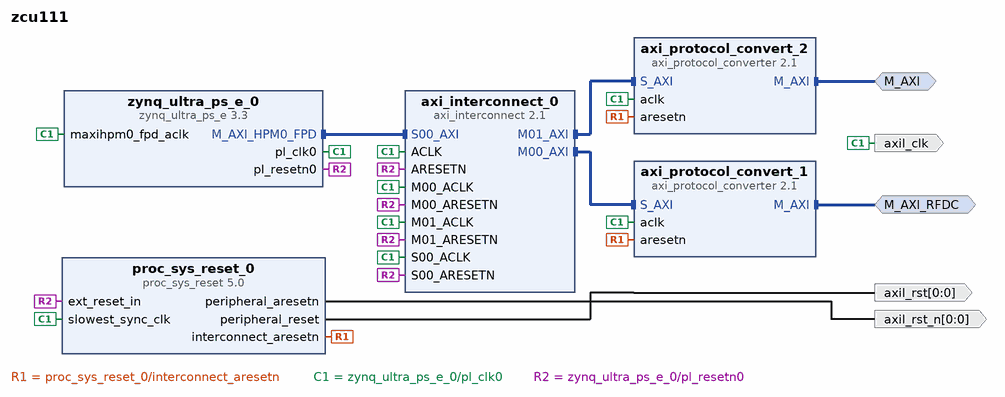
[diagram p0: block diagram of the top level]
# Vivado block design zcu111, xczu28dr-ffvg1517-2-e, Vivado 2019.1.3
create_bd_design zcu111

create_bd_intf_port -mode Master -vlnv xilinx.com:interface:aximm_rtl:1.0 M_AXI
set_property -dict [list \
  CONFIG.ADDR_WIDTH 32 \
  CONFIG.DATA_WIDTH 32 \
  CONFIG.HAS_BURST 0 \
  CONFIG.HAS_CACHE 0 \
  CONFIG.HAS_LOCK 0 \
  CONFIG.HAS_QOS 0 \
  CONFIG.HAS_REGION 0 \
  CONFIG.PROTOCOL AXI4LITE \
] [get_bd_intf_ports M_AXI]
create_bd_intf_port -mode Master -vlnv xilinx.com:interface:aximm_rtl:1.0 M_AXI_RFDC
set_property -dict [list \
  CONFIG.ADDR_WIDTH 32 \
  CONFIG.DATA_WIDTH 32 \
  CONFIG.FREQ_HZ 99999001 \
  CONFIG.HAS_BURST 0 \
  CONFIG.HAS_CACHE 0 \
  CONFIG.HAS_LOCK 0 \
  CONFIG.HAS_QOS 0 \
  CONFIG.HAS_REGION 0 \
  CONFIG.PROTOCOL AXI4LITE \
] [get_bd_intf_ports M_AXI_RFDC]
create_bd_port -dir O -type clk axil_clk
set_property -dict {CONFIG.ASSOCIATED_BUSIF M_AXI} [get_bd_ports axil_clk]
create_bd_port -dir O -from 0 -to 0 -type rst axil_rst
create_bd_port -dir O -from 0 -to 0 -type rst axil_rst_n

create_bd_cell -type ip -vlnv xilinx.com:ip:axi_interconnect:2.1 axi_interconnect_0
create_bd_cell -type ip -vlnv xilinx.com:ip:axi_protocol_converter:2.1 axi_protocol_convert_1
create_bd_cell -type ip -vlnv xilinx.com:ip:axi_protocol_converter:2.1 axi_protocol_convert_2
set_property -dict [list \
  CONFIG.ADDR_WIDTH 40 \
  CONFIG.DATA_WIDTH 32 \
  CONFIG.MI_PROTOCOL AXI4LITE \
  CONFIG.SI_PROTOCOL AXI4 \
  CONFIG.TRANSLATION_MODE 2 \
] [get_bd_cells axi_protocol_convert_2]
create_bd_cell -type ip -vlnv xilinx.com:ip:proc_sys_reset:5.0 proc_sys_reset_0
create_bd_cell -type ip -vlnv xilinx.com:ip:zynq_ultra_ps_e:3.3 zynq_ultra_ps_e_0
set_property -dict [list \
  CONFIG.PSU_BANK_0_IO_STANDARD LVCMOS18 \
  CONFIG.PSU_BANK_1_IO_STANDARD LVCMOS18 \
  CONFIG.PSU_BANK_2_IO_STANDARD LVCMOS18 \
  CONFIG.PSU_USB3__DUAL_CLOCK_ENABLE 1 \
  CONFIG.PSU__CAN1__PERIPHERAL__ENABLE 0 \
  CONFIG.PSU__CRF_APB__ACPU_CTRL__FREQMHZ 1200 \
  CONFIG.PSU__CRF_APB__ACPU_CTRL__SRCSEL APLL \
  CONFIG.PSU__CRF_APB__APLL_CTRL__SRCSEL PSS_REF_CLK \
  CONFIG.PSU__CRF_APB__DBG_FPD_CTRL__FREQMHZ 250 \
  CONFIG.PSU__CRF_APB__DBG_FPD_CTRL__SRCSEL IOPLL \
  CONFIG.PSU__CRF_APB__DBG_TRACE_CTRL__FREQMHZ 250 \
  CONFIG.PSU__CRF_APB__DBG_TRACE_CTRL__SRCSEL IOPLL \
  CONFIG.PSU__CRF_APB__DBG_TSTMP_CTRL__FREQMHZ 250 \
  CONFIG.PSU__CRF_APB__DBG_TSTMP_CTRL__SRCSEL IOPLL \
  CONFIG.PSU__CRF_APB__DDR_CTRL__FREQMHZ 1067 \
  CONFIG.PSU__CRF_APB__DDR_CTRL__SRCSEL DPLL \
  CONFIG.PSU__CRF_APB__DPDMA_REF_CTRL__FREQMHZ 600 \
  CONFIG.PSU__CRF_APB__DPDMA_REF_CTRL__SRCSEL APLL \
  CONFIG.PSU__CRF_APB__DPLL_CTRL__SRCSEL PSS_REF_CLK \
  CONFIG.PSU__CRF_APB__DP_AUDIO_REF_CTRL__SRCSEL RPLL \
  CONFIG.PSU__CRF_APB__DP_STC_REF_CTRL__SRCSEL RPLL \
  CONFIG.PSU__CRF_APB__DP_VIDEO_REF_CTRL__SRCSEL VPLL \
  CONFIG.PSU__CRF_APB__GDMA_REF_CTRL__FREQMHZ 600 \
  CONFIG.PSU__CRF_APB__GDMA_REF_CTRL__SRCSEL APLL \
  CONFIG.PSU__CRF_APB__GPU_REF_CTRL__FREQMHZ 500 \
  CONFIG.PSU__CRF_APB__GPU_REF_CTRL__SRCSEL IOPLL \
  CONFIG.PSU__CRF_APB__TOPSW_LSBUS_CTRL__FREQMHZ 100 \
  CONFIG.PSU__CRF_APB__TOPSW_LSBUS_CTRL__SRCSEL IOPLL \
  CONFIG.PSU__CRF_APB__TOPSW_MAIN_CTRL__FREQMHZ 533.33 \
  CONFIG.PSU__CRF_APB__TOPSW_MAIN_CTRL__SRCSEL DPLL \
  CONFIG.PSU__CRF_APB__VPLL_CTRL__SRCSEL PSS_REF_CLK \
  CONFIG.PSU__CRL_APB__ADMA_REF_CTRL__FREQMHZ 500 \
  CONFIG.PSU__CRL_APB__ADMA_REF_CTRL__SRCSEL IOPLL \
  CONFIG.PSU__CRL_APB__CAN1_REF_CTRL__FREQMHZ 100 \
  CONFIG.PSU__CRL_APB__CAN1_REF_CTRL__SRCSEL IOPLL \
  CONFIG.PSU__CRL_APB__CPU_R5_CTRL__FREQMHZ 500 \
  CONFIG.PSU__CRL_APB__CPU_R5_CTRL__SRCSEL IOPLL \
  CONFIG.PSU__CRL_APB__DBG_LPD_CTRL__FREQMHZ 250 \
  CONFIG.PSU__CRL_APB__DBG_LPD_CTRL__SRCSEL IOPLL \
  CONFIG.PSU__CRL_APB__GEM3_REF_CTRL__FREQMHZ 125 \
  CONFIG.PSU__CRL_APB__GEM3_REF_CTRL__SRCSEL IOPLL \
  CONFIG.PSU__CRL_APB__I2C0_REF_CTRL__FREQMHZ 100 \
  CONFIG.PSU__CRL_APB__I2C0_REF_CTRL__SRCSEL IOPLL \
  CONFIG.PSU__CRL_APB__I2C1_REF_CTRL__FREQMHZ 100 \
  CONFIG.PSU__CRL_APB__I2C1_REF_CTRL__SRCSEL IOPLL \
  CONFIG.PSU__CRL_APB__IOPLL_CTRL__SRCSEL PSS_REF_CLK \
  CONFIG.PSU__CRL_APB__IOU_SWITCH_CTRL__FREQMHZ 250 \
  CONFIG.PSU__CRL_APB__IOU_SWITCH_CTRL__SRCSEL IOPLL \
  CONFIG.PSU__CRL_APB__LPD_LSBUS_CTRL__FREQMHZ 100 \
  CONFIG.PSU__CRL_APB__LPD_LSBUS_CTRL__SRCSEL IOPLL \
  CONFIG.PSU__CRL_APB__LPD_SWITCH_CTRL__FREQMHZ 500 \
  CONFIG.PSU__CRL_APB__LPD_SWITCH_CTRL__SRCSEL IOPLL \
  CONFIG.PSU__CRL_APB__PCAP_CTRL__FREQMHZ 200 \
  CONFIG.PSU__CRL_APB__PCAP_CTRL__SRCSEL IOPLL \
  CONFIG.PSU__CRL_APB__PL0_REF_CTRL__FREQMHZ 100 \
  CONFIG.PSU__CRL_APB__PL0_REF_CTRL__SRCSEL IOPLL \
  CONFIG.PSU__CRL_APB__QSPI_REF_CTRL__FREQMHZ 125 \
  CONFIG.PSU__CRL_APB__QSPI_REF_CTRL__SRCSEL IOPLL \
  CONFIG.PSU__CRL_APB__RPLL_CTRL__SRCSEL PSS_REF_CLK \
  CONFIG.PSU__CRL_APB__SDIO1_REF_CTRL__FREQMHZ 200 \
  CONFIG.PSU__CRL_APB__SDIO1_REF_CTRL__SRCSEL IOPLL \
  CONFIG.PSU__CRL_APB__TIMESTAMP_REF_CTRL__FREQMHZ 100 \
  CONFIG.PSU__CRL_APB__TIMESTAMP_REF_CTRL__SRCSEL IOPLL \
  CONFIG.PSU__CRL_APB__UART0_REF_CTRL__FREQMHZ 100 \
  CONFIG.PSU__CRL_APB__UART0_REF_CTRL__SRCSEL IOPLL \
  CONFIG.PSU__CRL_APB__UART1_REF_CTRL__FREQMHZ 100 \
  CONFIG.PSU__CRL_APB__UART1_REF_CTRL__SRCSEL IOPLL \
  CONFIG.PSU__CRL_APB__USB0_BUS_REF_CTRL__FREQMHZ 250 \
  CONFIG.PSU__CRL_APB__USB0_BUS_REF_CTRL__SRCSEL IOPLL \
  CONFIG.PSU__CRL_APB__USB3_DUAL_REF_CTRL__FREQMHZ 20 \
  CONFIG.PSU__CRL_APB__USB3_DUAL_REF_CTRL__SRCSEL IOPLL \
  CONFIG.PSU__CRL_APB__USB3__ENABLE 1 \
  CONFIG.PSU__CSUPMU__PERIPHERAL__VALID 1 \
  CONFIG.PSU__DDRC__BUS_WIDTH {64 Bit} \
  CONFIG.PSU__DDRC__COMPONENTS UDIMM \
  CONFIG.PSU__DDRC__DEVICE_CAPACITY {8192 MBits} \
  CONFIG.PSU__DDRC__DRAM_WIDTH {16 Bits} \
  CONFIG.PSU__DDRC__ECC Disabled \
  CONFIG.PSU__DDRC__MEMORY_TYPE {DDR 4} \
  CONFIG.PSU__DDRC__SPEED_BIN DDR4_2133P \
  CONFIG.PSU__DDR_HIGH_ADDRESS_GUI_ENABLE 1 \
  CONFIG.PSU__DDR__INTERFACE__FREQMHZ 533.500 \
  CONFIG.PSU__DISPLAYPORT__LANE0__ENABLE 1 \
  CONFIG.PSU__DISPLAYPORT__LANE0__IO {GT Lane1} \
  CONFIG.PSU__DISPLAYPORT__LANE1__ENABLE 1 \
  CONFIG.PSU__DISPLAYPORT__LANE1__IO {GT Lane0} \
  CONFIG.PSU__DISPLAYPORT__PERIPHERAL__ENABLE 1 \
  CONFIG.PSU__DLL__ISUSED 1 \
  CONFIG.PSU__DPAUX__PERIPHERAL__ENABLE 1 \
  CONFIG.PSU__DPAUX__PERIPHERAL__IO {MIO 27 .. 30} \
  CONFIG.PSU__DP__LANE_SEL {Dual Lower} \
  CONFIG.PSU__DP__REF_CLK_FREQ 27 \
  CONFIG.PSU__DP__REF_CLK_SEL {Ref Clk1} \
  CONFIG.PSU__ENET3__FIFO__ENABLE 0 \
  CONFIG.PSU__ENET3__GRP_MDIO__ENABLE 1 \
  CONFIG.PSU__ENET3__GRP_MDIO__IO {MIO 76 .. 77} \
  CONFIG.PSU__ENET3__PERIPHERAL__ENABLE 1 \
  CONFIG.PSU__ENET3__PERIPHERAL__IO {MIO 64 .. 75} \
  CONFIG.PSU__ENET3__PTP__ENABLE 0 \
  CONFIG.PSU__ENET3__TSU__ENABLE 0 \
  CONFIG.PSU__FPGA_PL0_ENABLE 1 \
  CONFIG.PSU__GEM3_COHERENCY 0 \
  CONFIG.PSU__GEM3_ROUTE_THROUGH_FPD 0 \
  CONFIG.PSU__GEM__TSU__ENABLE 0 \
  CONFIG.PSU__GPIO0_MIO__IO {MIO 0 .. 25} \
  CONFIG.PSU__GPIO0_MIO__PERIPHERAL__ENABLE 1 \
  CONFIG.PSU__GPIO1_MIO__IO {MIO 26 .. 51} \
  CONFIG.PSU__GPIO1_MIO__PERIPHERAL__ENABLE 1 \
  CONFIG.PSU__GT__LINK_SPEED HBR \
  CONFIG.PSU__GT__PRE_EMPH_LVL_4 0 \
  CONFIG.PSU__GT__VLT_SWNG_LVL_4 0 \
  CONFIG.PSU__I2C0__PERIPHERAL__ENABLE 1 \
  CONFIG.PSU__I2C0__PERIPHERAL__IO {MIO 14 .. 15} \
  CONFIG.PSU__I2C1__PERIPHERAL__ENABLE 1 \
  CONFIG.PSU__I2C1__PERIPHERAL__IO {MIO 16 .. 17} \
  CONFIG.PSU__IOU_SLCR__IOU_TTC_APB_CLK__TTC0_SEL APB \
  CONFIG.PSU__IOU_SLCR__IOU_TTC_APB_CLK__TTC1_SEL APB \
  CONFIG.PSU__IOU_SLCR__IOU_TTC_APB_CLK__TTC2_SEL APB \
  CONFIG.PSU__IOU_SLCR__IOU_TTC_APB_CLK__TTC3_SEL APB \
  CONFIG.PSU__MAXIGP0__DATA_WIDTH 128 \
  CONFIG.PSU__OVERRIDE__BASIC_CLOCK 0 \
  CONFIG.PSU__PMU_COHERENCY 0 \
  CONFIG.PSU__PMU__AIBACK__ENABLE 0 \
  CONFIG.PSU__PMU__EMIO_GPI__ENABLE 0 \
  CONFIG.PSU__PMU__EMIO_GPO__ENABLE 0 \
  CONFIG.PSU__PMU__GPI0__ENABLE 0 \
  CONFIG.PSU__PMU__GPI1__ENABLE 0 \
  CONFIG.PSU__PMU__GPI2__ENABLE 0 \
  CONFIG.PSU__PMU__GPI3__ENABLE 0 \
  CONFIG.PSU__PMU__GPI4__ENABLE 0 \
  CONFIG.PSU__PMU__GPI5__ENABLE 0 \
  CONFIG.PSU__PMU__GPO0__ENABLE 1 \
  CONFIG.PSU__PMU__GPO0__IO {MIO 32} \
  CONFIG.PSU__PMU__GPO1__ENABLE 1 \
  CONFIG.PSU__PMU__GPO1__IO {MIO 33} \
  CONFIG.PSU__PMU__GPO2__ENABLE 1 \
  CONFIG.PSU__PMU__GPO2__IO {MIO 34} \
  CONFIG.PSU__PMU__GPO2__POLARITY low \
  CONFIG.PSU__PMU__GPO3__ENABLE 1 \
  CONFIG.PSU__PMU__GPO3__IO {MIO 35} \
  CONFIG.PSU__PMU__GPO3__POLARITY low \
  CONFIG.PSU__PMU__GPO4__ENABLE 1 \
  CONFIG.PSU__PMU__GPO4__IO {MIO 36} \
  CONFIG.PSU__PMU__GPO4__POLARITY low \
  CONFIG.PSU__PMU__GPO5__ENABLE 1 \
  CONFIG.PSU__PMU__GPO5__IO {MIO 37} \
  CONFIG.PSU__PMU__GPO5__POLARITY low \
  CONFIG.PSU__PMU__PERIPHERAL__ENABLE 1 \
  CONFIG.PSU__PMU__PLERROR__ENABLE 0 \
  CONFIG.PSU__PRESET_APPLIED 1 \
  CONFIG.PSU__PSS_REF_CLK__FREQMHZ 33.333 \
  CONFIG.PSU__QSPI_COHERENCY 0 \
  CONFIG.PSU__QSPI_ROUTE_THROUGH_FPD 0 \
  CONFIG.PSU__QSPI__GRP_FBCLK__ENABLE 1 \
  CONFIG.PSU__QSPI__GRP_FBCLK__IO {MIO 6} \
  CONFIG.PSU__QSPI__PERIPHERAL__DATA_MODE x4 \
  CONFIG.PSU__QSPI__PERIPHERAL__ENABLE 1 \
  CONFIG.PSU__QSPI__PERIPHERAL__IO {MIO 0 .. 12} \
  CONFIG.PSU__QSPI__PERIPHERAL__MODE {Dual Parallel} \
  CONFIG.PSU__SATA__LANE1__IO {GT Lane3} \
  CONFIG.PSU__SATA__PERIPHERAL__ENABLE 1 \
  CONFIG.PSU__SATA__REF_CLK_FREQ 125 \
  CONFIG.PSU__SATA__REF_CLK_SEL {Ref Clk3} \
  CONFIG.PSU__SD1_COHERENCY 0 \
  CONFIG.PSU__SD1_ROUTE_THROUGH_FPD 0 \
  CONFIG.PSU__SD1__DATA_TRANSFER_MODE 8Bit \
  CONFIG.PSU__SD1__GRP_CD__ENABLE 1 \
  CONFIG.PSU__SD1__GRP_CD__IO {MIO 45} \
  CONFIG.PSU__SD1__GRP_POW__ENABLE 0 \
  CONFIG.PSU__SD1__GRP_WP__ENABLE 0 \
  CONFIG.PSU__SD1__PERIPHERAL__ENABLE 1 \
  CONFIG.PSU__SD1__PERIPHERAL__IO {MIO 39 .. 51} \
  CONFIG.PSU__SD1__SLOT_TYPE {SD 3.0} \
  CONFIG.PSU__SWDT0__CLOCK__ENABLE 0 \
  CONFIG.PSU__SWDT0__PERIPHERAL__ENABLE 1 \
  CONFIG.PSU__SWDT0__RESET__ENABLE 0 \
  CONFIG.PSU__SWDT1__CLOCK__ENABLE 0 \
  CONFIG.PSU__SWDT1__PERIPHERAL__ENABLE 1 \
  CONFIG.PSU__SWDT1__RESET__ENABLE 0 \
  CONFIG.PSU__TSU__BUFG_PORT_PAIR 0 \
  CONFIG.PSU__TTC0__CLOCK__ENABLE 0 \
  CONFIG.PSU__TTC0__PERIPHERAL__ENABLE 1 \
  CONFIG.PSU__TTC0__WAVEOUT__ENABLE 0 \
  CONFIG.PSU__TTC1__CLOCK__ENABLE 0 \
  CONFIG.PSU__TTC1__PERIPHERAL__ENABLE 1 \
  CONFIG.PSU__TTC1__WAVEOUT__ENABLE 0 \
  CONFIG.PSU__TTC2__CLOCK__ENABLE 0 \
  CONFIG.PSU__TTC2__PERIPHERAL__ENABLE 1 \
  CONFIG.PSU__TTC2__WAVEOUT__ENABLE 0 \
  CONFIG.PSU__TTC3__CLOCK__ENABLE 0 \
  CONFIG.PSU__TTC3__PERIPHERAL__ENABLE 1 \
  CONFIG.PSU__TTC3__WAVEOUT__ENABLE 0 \
  CONFIG.PSU__UART0__BAUD_RATE 115200 \
  CONFIG.PSU__UART0__MODEM__ENABLE 0 \
  CONFIG.PSU__UART0__PERIPHERAL__ENABLE 1 \
  CONFIG.PSU__UART0__PERIPHERAL__IO {MIO 18 .. 19} \
  CONFIG.PSU__UART1__BAUD_RATE 115200 \
  CONFIG.PSU__UART1__MODEM__ENABLE 0 \
  CONFIG.PSU__UART1__PERIPHERAL__ENABLE 1 \
  CONFIG.PSU__UART1__PERIPHERAL__IO EMIO \
  CONFIG.PSU__USB0_COHERENCY 0 \
  CONFIG.PSU__USB0__PERIPHERAL__ENABLE 1 \
  CONFIG.PSU__USB0__PERIPHERAL__IO {MIO 52 .. 63} \
  CONFIG.PSU__USB0__REF_CLK_FREQ 26 \
  CONFIG.PSU__USB0__REF_CLK_SEL {Ref Clk2} \
  CONFIG.PSU__USB2_0__EMIO__ENABLE 0 \
  CONFIG.PSU__USB3_0__EMIO__ENABLE 0 \
  CONFIG.PSU__USB3_0__PERIPHERAL__ENABLE 1 \
  CONFIG.PSU__USB3_0__PERIPHERAL__IO {GT Lane2} \
  CONFIG.PSU__USB__RESET__MODE {Boot Pin} \
  CONFIG.PSU__USB__RESET__POLARITY {Active Low} \
  CONFIG.PSU__USE__IRQ0 1 \
  CONFIG.PSU__USE__M_AXI_GP0 1 \
  CONFIG.PSU__USE__M_AXI_GP1 0 \
  CONFIG.PSU__USE__M_AXI_GP2 0 \
  CONFIG.SUBPRESET1 Custom \
] [get_bd_cells zynq_ultra_ps_e_0]
# 100 more settings of zynq_ultra_ps_e_0 are not shown: defaults, MIO pin electricals, DDR timing, and values the tool derives

# ---- connections ----

connect_bd_intf_net [get_bd_intf_pins axi_interconnect_0/M00_AXI] [get_bd_intf_pins axi_protocol_convert_1/S_AXI]
connect_bd_intf_net [get_bd_intf_pins axi_interconnect_0/S00_AXI] [get_bd_intf_pins zynq_ultra_ps_e_0/M_AXI_HPM0_FPD]
connect_bd_intf_net [get_bd_intf_ports M_AXI] [get_bd_intf_pins axi_protocol_convert_2/M_AXI]
connect_bd_intf_net [get_bd_intf_ports M_AXI_RFDC] [get_bd_intf_pins axi_protocol_convert_1/M_AXI]
connect_bd_intf_net [get_bd_intf_pins axi_interconnect_0/M01_AXI] [get_bd_intf_pins axi_protocol_convert_2/S_AXI]
connect_bd_net [get_bd_pins proc_sys_reset_0/interconnect_aresetn] \
  [get_bd_pins axi_protocol_convert_1/aresetn] [get_bd_pins axi_protocol_convert_2/aresetn]
connect_bd_net [get_bd_pins proc_sys_reset_0/peripheral_aresetn] [get_bd_ports axil_rst_n]
connect_bd_net [get_bd_pins proc_sys_reset_0/peripheral_reset] [get_bd_ports axil_rst]
connect_bd_net [get_bd_pins zynq_ultra_ps_e_0/pl_clk0] \
  [get_bd_ports axil_clk] [get_bd_pins axi_interconnect_0/ACLK] [get_bd_pins axi_interconnect_0/M00_ACLK] \
  [get_bd_pins axi_interconnect_0/M01_ACLK] [get_bd_pins axi_interconnect_0/S00_ACLK] \
  [get_bd_pins axi_protocol_convert_1/aclk] [get_bd_pins axi_protocol_convert_2/aclk] \
  [get_bd_pins proc_sys_reset_0/slowest_sync_clk] [get_bd_pins zynq_ultra_ps_e_0/maxihpm0_fpd_aclk]
connect_bd_net [get_bd_pins zynq_ultra_ps_e_0/pl_resetn0] \
  [get_bd_pins axi_interconnect_0/ARESETN] [get_bd_pins axi_interconnect_0/M00_ARESETN] \
  [get_bd_pins axi_interconnect_0/M01_ARESETN] [get_bd_pins axi_interconnect_0/S00_ARESETN] \
  [get_bd_pins proc_sys_reset_0/ext_reset_in]

# ---- address map ----
assign_bd_address -offset 0x00A0000000 -range 8M -target_address_space [get_bd_addr_spaces zynq_ultra_ps_e_0/Data] [get_bd_addr_segs M_AXI/Reg]
assign_bd_address -offset 0x00A0800000 -range 256K -target_address_space [get_bd_addr_spaces zynq_ultra_ps_e_0/Data] [get_bd_addr_segs M_AXI_RFDC/Reg]

validate_bd_design
save_bd_design
